# EAGLE design motherboard fully tracked (EAGLE 5.11)
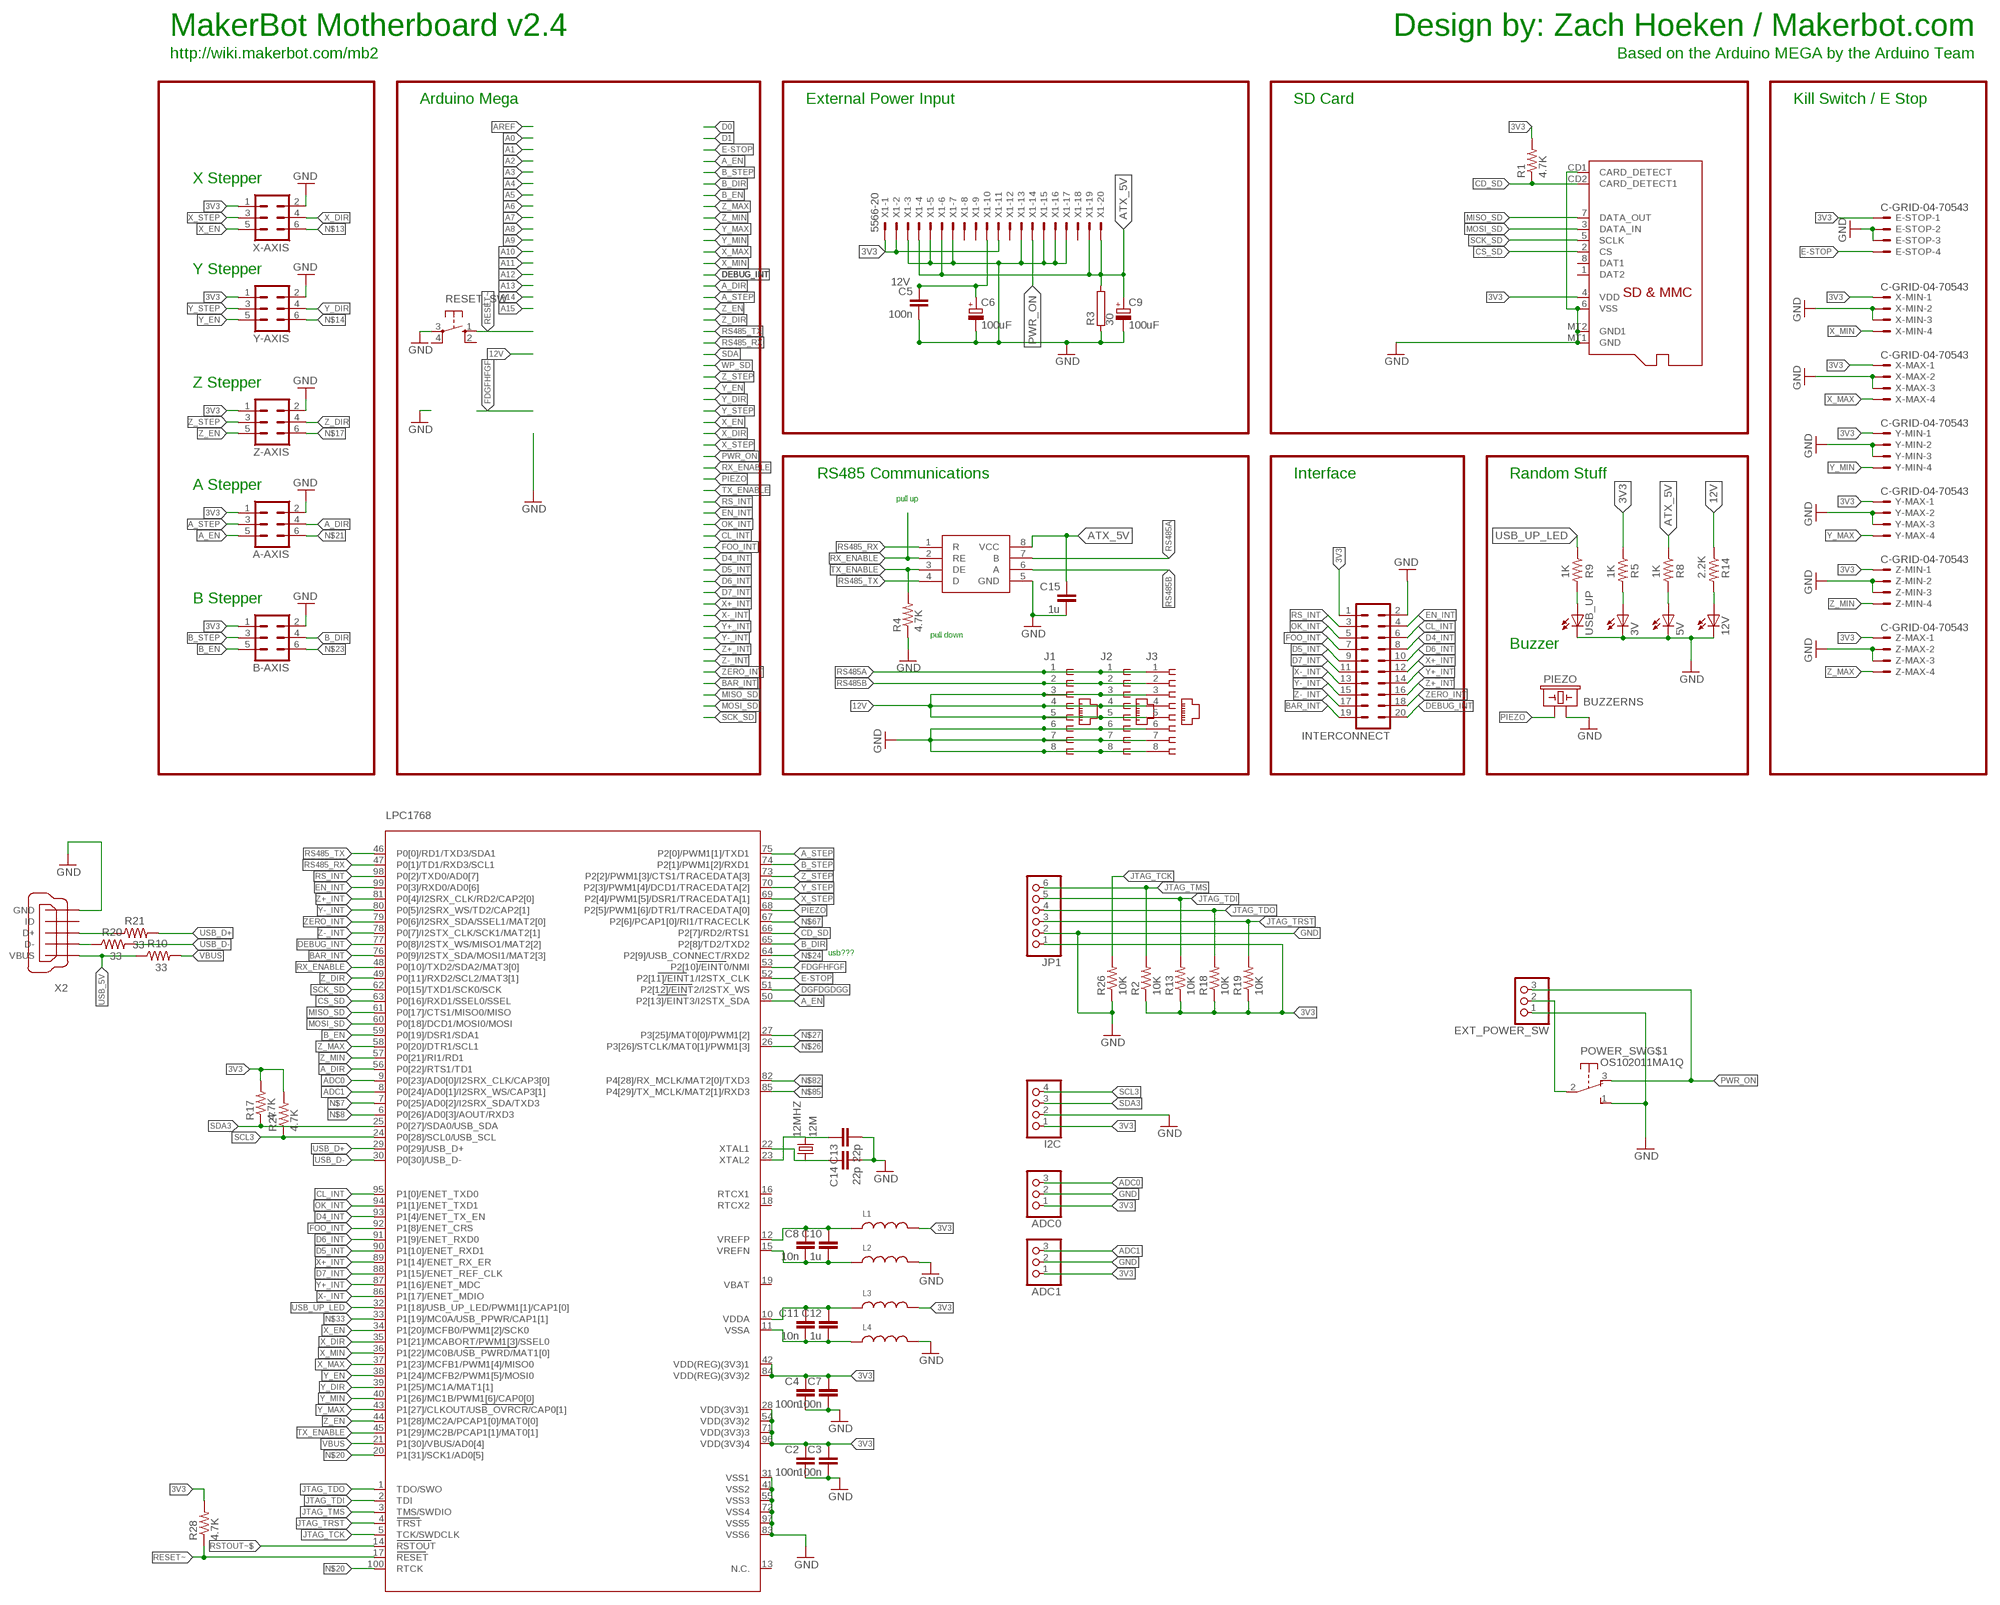
[diagram p0: schematic, sheet 1]

## Parts
3V  LED0805  [LED-0805]
5V  LED0805  [LED-0805]
12MHZ  12M  CRYSTALHC49U-V  [HC49U-V]
12V  LED0805  [LED-0805]
A-AXIS  MA03-2  [MA03-2]
ADC0  HEADER-1X3ROUND  [1X03_ROUND]
ADC1  HEADER-1X3ROUND  [1X03_ROUND]
B-AXIS  MA03-2  [MA03-2]
C2  100n  CAP0805  [0805]
C3  100n  CAP0805  [0805]
C4  100n  CAP0805  [0805]
C5  100n  CAP0805  [0805]
C6  100uF  CPOL-EUE2.5-5  [E2,5-5]
C7  100n  CAP0805  [0805]
C8  10n  CAP0805  [0805]
C9  100uF  CPOL-EUE2.5-5  [E2,5-5]
C10  1u  CAP0805  [0805]
C11  10n  CAP0805  [0805]
C12  1u  CAP0805  [0805]
C13  22p  CAP0805  [0805]
C14  22p  CAP0805  [0805]
C15  1u  CAP0805  [0805]
E-STOP  C-GRID-04-70543  [70543-04]
EXT_POWER_SW  HEADER-1X3ROUND  [1X03_ROUND]
I2C  HEADER-1X4ROUND  [1X04_ROUND]
INTERCONNECT  MA10-2  [MA10-2]
J1  556416-1  [556416-1]
J2  556416-1  [556416-1]
J3  556416-1  [556416-1]
JP1  HEADER-1X6ROUND  [1X06_ROUND]
L1  INDUCTOR0603  [0603]
L2  INDUCTOR0603  [0603]
L3  INDUCTOR0603  [0603]
L4  INDUCTOR0603  [0603]
LPC1768  LPC1768  [LQFP100]
MICRO_SD  MICROSD  [MICROSD]
PIEZO  BUZZERNS  [BUZZER-12MM-NS]
POWER_SW  OS102011MA1Q  [OS102011MA1Q]
R1  4.7K  RESISTOR  [0805]
R2  10K  RESISTOR  [0805]
R3  30  RKH208-8R  [KH208R-8]
R4  4.7K  RESISTOR  [0805]
R5  1K  RESISTOR  [0805]
R8  1K  RESISTOR  [0805]
R9  1K  RESISTOR  [0805]
R10  33  RESISTOR  [0805]
R13  10K  RESISTOR  [0805]
R14  2.2K  RESISTOR  [0805]
R17  4.7K  RESISTOR  [0805]
R18  10K  RESISTOR  [0805]
R19  10K  RESISTOR  [0805]
R20  33  RESISTOR  [0805]
R21  33  RESISTOR  [0805]
R26  10K  RESISTOR  [0805]
R27  4.7K  RESISTOR  [0805]
R28  4.7K  RESISTOR  [0805]
RESET_SW  10-XX  [B3F-10XX]
RS244  SN75176ASOIC  [SO08]
USB_UP  LED0805  [LED-0805]
X1  5566-20  [5566-20]
X2  MINI-USB_SHIELD5P2-32005-601  [32005-601]
X-AXIS  MA03-2  [MA03-2]
X-MAX  C-GRID-04-70543  [70543-04]
X-MIN  C-GRID-04-70543  [70543-04]
Y-AXIS  MA03-2  [MA03-2]
Y-MAX  C-GRID-04-70543  [70543-04]
Y-MIN  C-GRID-04-70543  [70543-04]
Z-AXIS  MA03-2  [MA03-2]
Z-MAX  C-GRID-04-70543  [70543-04]
Z-MIN  C-GRID-04-70543  [70543-04]

## Nets
3V3: A-AXIS.1 ADC0.1 ADC1.1 B-AXIS.1 C2.1 C3.1 C4.1 C7.1 E-STOP.1 I2C.1 INTERCONNECT.1 JP1.1 L1.2 L3.2 LPC1768.28(VDD(3V3)1) LPC1768.42(VDD(REG)(3V3)1) LPC1768.54(VDD(3V3)2) LPC1768.71(VDD(3V3)3) LPC1768.84(VDD(REG)(3V3)2) LPC1768.96(VDD(3V3)4) MICRO_SD.4(VDD) R1.2 R2.1 R5.1 R13.1 R17.2 R18.1 R19.1 R27.2 R28.2 X1.1 X1.2 X1.11 X-AXIS.1 X-MAX.1 X-MIN.1 Y-AXIS.1 Y-MAX.1 Y-MIN.1 Z-AXIS.1 Z-MAX.1 Z-MIN.1
12V [12v]: C5.1 C6.+ J1.3 J1.4 J1.5 J2.3 J2.4 J2.5 J3.3 J3.4 J3.5 R14.1 X1.10
A_DIR: A-AXIS.4 LPC1768.56(P0[22]/RTS1/TD1)
A_EN: A-AXIS.5 LPC1768.50(P2[13]/EINT3/I2STX_SDA)
A_STEP: A-AXIS.3 LPC1768.75(P2[0]/PWM1[1]/TXD1)
ADC0: ADC0.3 LPC1768.9(P0[23]/AD0[0]/I2SRX_CLK/CAP3[0])
ADC1: ADC1.3 LPC1768.8(P0[24]/AD0[1]/I2SRX_WS/CAP3[1])
ATX_5V [power]: C9.+ C15.1 R3.2 R8.1 RS244.8(VCC) X1.4 X1.6 X1.19 X1.20
B_DIR: B-AXIS.4 LPC1768.65(P2[8]/TD2/TXD2)
B_EN: B-AXIS.5 LPC1768.59(P0[19]/DSR1/SDA1)
B_STEP: B-AXIS.3 LPC1768.74(P2[1]/PWM1[2]/RXD1)
BAR_INT: INTERCONNECT.19 LPC1768.76(P0[9]/I2STX_SDA/MOSI1/MAT2[3])
CD_SD: LPC1768.66(P2[7]/RD2/RTS1) MICRO_SD.CD2(CARD_DETECT1) R1.1
CL_INT: INTERCONNECT.6 LPC1768.95(P1[0]/ENET_TXD0)
CS_SD: LPC1768.63(P0[16]/RXD1/SSEL0/SSEL) MICRO_SD.2(CS)
D4_INT: INTERCONNECT.8 LPC1768.93(P1[4]/ENET_TX_EN)
D5_INT: INTERCONNECT.9 LPC1768.90(P1[10]/ENET_RXD1)
D6_INT: INTERCONNECT.10 LPC1768.91(P1[9]/ENET_RXD0)
D7_INT: INTERCONNECT.11 LPC1768.88(P1[15]/ENET_REF_CLK)
DEBUG_INT: INTERCONNECT.20 LPC1768.77(P0[8]/I2STX_WS/MISO1/MAT2[2])
DGFDGDGG: LPC1768.51(P2[12]/EINT2/I2STX_WS)
E-STOP: E-STOP.4 LPC1768.52(P2[11]/EINT1/I2STX_CLK)
EN_INT: INTERCONNECT.4 LPC1768.99(P0[3]/RXD0/AD0[6])
FDGFHFGF: LPC1768.53(P2[10]/EINT0/NMI)
FOO_INT: INTERCONNECT.7 LPC1768.92(P1[8]/ENET_CRS)
GND [gnd]: 3V.C 5V.C 12V.C A-AXIS.2 ADC0.2 ADC1.2 B-AXIS.2 C2.2 C3.2 C4.2 C5.2 C6.- C7.2 C9.- C13.2 C14.2 C15.2 E-STOP.2 E-STOP.3 EXT_POWER_SW.1 I2C.2 INTERCONNECT.2 J1.6 J1.7 J1.8 J2.6 J2.7 J2.8 J3.6 J3.7 J3.8 JP1.2 L2.2 L4.2 LPC1768.31(VSS1) LPC1768.41(VSS2) LPC1768.55(VSS3) LPC1768.72(VSS4) LPC1768.83(VSS6) LPC1768.97(VSS5) MICRO_SD.6(VSS) MICRO_SD.CD1(CARD_DETECT) MICRO_SD.MT1(GND) MICRO_SD.MT2(GND1) PIEZO.- POWER_SW.1(S) R3.1 R4.1 R26.1 RESET_SW.3(P) RS244.5(GND) USB_UP.C X1.3 X1.5 X1.7 X1.13 X1.15 X1.16 X1.17 X2.5(GND) X-AXIS.2 X-MAX.2 X-MAX.3 X-MIN.2 X-MIN.3 Y-AXIS.2 Y-MAX.2 Y-MAX.3 Y-MIN.2 Y-MIN.3 Z-AXIS.2 Z-MAX.2 Z-MAX.3 Z-MIN.2 Z-MIN.3
JTAG_TCK: LPC1768.5(TCK/SWDCLK) R26.2
JTAG_TDI: JP1.5 LPC1768.2(TDI) R13.2
JTAG_TDO: JP1.4 LPC1768.1(TDO/SWO) R18.2
JTAG_TMS: JP1.6 LPC1768.3(TMS/SWDIO) R2.2
JTAG_TRST: JP1.3 LPC1768.4(TRST) R19.2
MISO_SD: LPC1768.61(P0[17]/CTS1/MISO0/MISO) MICRO_SD.7(DATA_OUT)
MOSI_SD: LPC1768.60(P0[18]/DCD1/MOSI0/MOSI) MICRO_SD.3(DATA_IN)
N$1: 3V.A R5.2
N$2: R9.2 USB_UP.A
N$3: 5V.A R8.2
N$4: EXT_POWER_SW.2 POWER_SW.2(P)
N$7: LPC1768.7(P0[25]/AD0[2]/I2SRX_SDA/TXD3)
N$8: LPC1768.6(P0[26]/AD0[3]/AOUT/RXD3)
N$10: 12V.A R14.2
N$13: X-AXIS.6
N$14: Y-AXIS.6
N$17: Z-AXIS.6
N$20: LPC1768.20(P1[31]/SCK1/AD0[5]) LPC1768.100(RTCK)
N$21: A-AXIS.6
N$23: B-AXIS.6
N$24: LPC1768.64(P2[9]/USB_CONNECT/RXD2)
N$26: LPC1768.26(P3[26]/STCLK/MAT0[1]/PWM1[3])
N$27: LPC1768.27(P3[25]/MAT0[0]/PWM1[2])
N$31: C8.1 C10.1 L1.1 LPC1768.12(VREFP)
N$32: C8.2 C10.2 L2.1 LPC1768.15(VREFN)
N$33: 12MHZ.2 C13.1 LPC1768.23(XTAL2) LPC1768.33(P1[19]/MC0A/USB_PPWR/CAP1[1])
N$34: 12MHZ.1 C14.1 LPC1768.22(XTAL1)
N$35: C11.1 C12.1 L3.1 LPC1768.10(VDDA)
N$38: C11.2 C12.2 L4.1 LPC1768.11(VSSA)
N$67: LPC1768.67(P2[6]/PCAP1[0]/RI1/TRACECLK)
N$82: LPC1768.82(P4[28]/RX_MCLK/MAT2[0]/TXD3)
N$85: LPC1768.85(P4[29]/TX_MCLK/MAT2[1]/RXD3)
OK_INT: INTERCONNECT.5 LPC1768.94(P1[1]/ENET_TXD1)
PIEZO: LPC1768.68(P2[5]/PWM1[6]/DTR1/TRACEDATA[0]) PIEZO.+
PWR_ON: EXT_POWER_SW.3 POWER_SW.3(O) X1.14
RESET~: LPC1768.17(RESET) R28.1 RESET_SW.1(S)
RS485_RX: LPC1768.47(P0[1]/TD1/RXD3/SCL1) RS244.1(R)
RS485_TX: LPC1768.46(P0[0]/RD1/TXD3/SDA1) RS244.4(D)
RS485A: J1.1 J2.1 J3.1 RS244.7(B)
RS485B: J1.2 J2.2 J3.2 RS244.6(A)
RS_INT: INTERCONNECT.3 LPC1768.98(P0[2]/TXD0/AD0[7])
RSTOUT~$: LPC1768.14(RSTOUT)
RX_ENABLE: LPC1768.48(P0[10]/TXD2/SDA2/MAT3[0]) RS244.2(RE)
SCK_SD: LPC1768.62(P0[15]/TXD1/SCK0/SCK) MICRO_SD.5(SCLK)
SCL3: I2C.4 LPC1768.24(P0[28]/SCL0/USB_SCL) R27.1
SDA3: I2C.3 LPC1768.25(P0[27]/SDA0/USB_SDA) R17.1
TX_ENABLE: LPC1768.45(P1[29]/MC2B/PCAP1[1]/MAT0[1]) R4.2 RS244.3(DE)
USB_5V [12v]: R10.1 X2.1(VBUS)
USB_D+: LPC1768.29(P0[29]/USB_D+) R21.2
USB_D+_CON: R21.1 X2.3(D+)
USB_D-: LPC1768.30(P0[30]/USB_D-) R20.2
USB_D-_CON: R20.1 X2.2(D-)
USB_UP_LED: LPC1768.32(P1[18]/USB_UP_LED/PWM1[1]/CAP1[0]) R9.1
VBUS: LPC1768.21(P1[30]/VBUS/AD0[4]) R10.2
X+_INT: INTERCONNECT.12 LPC1768.89(P1[14]/ENET_RX_ER)
X-_INT: INTERCONNECT.13 LPC1768.86(P1[17]/ENET_MDIO)
X_DIR: LPC1768.35(P1[21]/MCABORT/PWM1[3]/SSEL0) X-AXIS.4
X_EN: LPC1768.34(P1[20]/MCFB0/PWM1[2]/SCK0) X-AXIS.5
X_MAX: LPC1768.37(P1[23]/MCFB1/PWM1[4]/MISO0) X-MAX.4
X_MIN: LPC1768.36(P1[22]/MC0B/USB_PWRD/MAT1[0]) X-MIN.4
X_STEP: LPC1768.69(P2[4]/PWM1[5]/DSR1/TRACEDATA[1]) X-AXIS.3
Y+_INT: INTERCONNECT.14 LPC1768.87(P1[16]/ENET_MDC)
Y-_INT: INTERCONNECT.15 LPC1768.80(P0[5]/I2SRX_WS/TD2/CAP2[1])
Y_DIR: LPC1768.39(P1[25]/MC1A/MAT1[1]) Y-AXIS.4
Y_EN: LPC1768.38(P1[24]/MCFB2/PWM1[5]/MOSI0) Y-AXIS.5
Y_MAX: LPC1768.43(P1[27]/CLKOUT/USB_OVRCR/CAP0[1]) Y-MAX.4
Y_MIN: LPC1768.40(P1[26]/MC1B/PWM1[6]/CAP0[0]) Y-MIN.4
Y_STEP: LPC1768.70(P2[3]/PWM1[4]/DCD1/TRACEDATA[2]) Y-AXIS.3
Z+_INT: INTERCONNECT.16 LPC1768.81(P0[4]/I2SRX_CLK/RD2/CAP2[0])
Z-_INT: INTERCONNECT.17 LPC1768.78(P0[7]/I2STX_CLK/SCK1/MAT2[1])
Z_DIR: LPC1768.49(P0[11]/RXD2/SCL2/MAT3[1]) Z-AXIS.4
Z_EN: LPC1768.44(P1[28]/MC2A/PCAP1[0]/MAT0[0]) Z-AXIS.5
Z_MAX: LPC1768.58(P0[20]/DTR1/SCL1) Z-MAX.4
Z_MIN: LPC1768.57(P0[21]/RI1/RD1) Z-MIN.4
Z_STEP: LPC1768.73(P2[2]/PWM1[3]/CTS1/TRACEDATA[3]) Z-AXIS.3
ZERO_INT: INTERCONNECT.18 LPC1768.79(P0[6]/I2SRX_SDA/SSEL1/MAT2[0])
Unconnected: LPC1768.13(N.C.) LPC1768.16(RTCX1) LPC1768.18(RTCX2) LPC1768.19(VBAT) MICRO_SD.1(DAT2) MICRO_SD.8(DAT1) POWER_SW.MT1(MT) POWER_SW.MT2(MT) RESET_SW.2(S1) RESET_SW.4(P1) X1.8 X1.9 X1.12 X1.18 X2.4(ID) X2.M1(S1) X2.M2(S2)

## Notes on the sheet
- Design by: Zach Hoeken / Makerbot.com
- MakerBot Motherboard v2.4
- Based on the Arduino MEGA by the Arduino Team
- http://wiki.makerbot.com/mb2
- Arduino Mega | External Power Input | SD Card | Kill Switch / E Stop
- X Stepper
- Y Stepper
- Z Stepper
- RS485 Communications | Interface | Random Stuff
- A Stepper
- pull up
- B Stepper
- pull down
- Buzzer
- usb???

## Library data of the parts
3V 5V 12V USB_UP = SparkFun:LED: LEDs Standard schematic elements and footprints for 5mm, 3mm, 1206, and 0603 sized LEDs. 5mm - Spark Fun Electronics SKU : COM-00529 (and others)
12MHZ = crystal:CRYSTAL: CRYSTAL; OC_FARNELL: 1666969; OC_NEWARK: unknown
A-AXIS B-AXIS X-AXIS Y-AXIS Z-AXIS = con-lstb:MA03-2: PIN HEADER; OC_FARNELL: unknown; OC_NEWARK: unknown
ADC0 ADC1 EXT_POWER_SW = microbuilder:HEADER-1X3: PIN HEADER
C2-C5 C7 C8 C10-C15 = SparkFun:CAP: Capacitor Standard 0603 ceramic capacitor, and 0.1" leaded capacitor.
C6 C9 = resistor:CPOL-EU: POLARIZED CAPACITOR, European symbol
E-STOP X-MAX X-MIN Y-MAX Y-MIN Z-MAX Z-MIN = con-molex:C-GRID-04: CONNECTOR wire to board 2.54 mm (0.100") pitch header; OC_FARNELL: unknown; OC_NEWARK: unknown
I2C = microbuilder:HEADER-1X4: PIN HEADER
INTERCONNECT = con-lstb:MA10-2: PIN HEADER; OC_FARNELL: unknown; OC_NEWARK: unknown
J1-J3 = con-amp:556416-1: AMP connector
JP1 = microbuilder:HEADER-1X6: PIN HEADER
L1-L4 = microbuilder:INDUCTOR: Inductors 0603: 10nH Ceramic Inductor - microwire antenna/RF (Digikey: 712-1434-2-ND) 0805: 560nH Ceramic Inductor - RF (Digikey: 553-1047-1-ND) 1007 (2518 Metric) SMT: 10µH 10% 250mOhm 820mA 1007 Inductor (Digikey: 587-2189-1-ND) 22µH 10% 500mOhm 580mA 1007 Inductor (Digikey: 587-2190-1-ND) 47µH 10% 950mOhm 420mA 1007 Inductor (Digikey: 587-2191-1-ND) 47µH 5% 100mOhm 1A 1008 Inductor (Digikey: 732-1816-1-ND)
LPC1768 = microbuilder:LPC1768: LPC1768 100 MHz 32-bit ARM Cortex-M3 based microcontroller featuring a high level of integration and low power consumption. 512 kB Flash, 64 kB SRAM, USB Device/Host/OTG, Ethernet, CAN, I2S, 10-bit DAC Digikey: 568-4796-ND
MICRO_SD = adafruit:MICROSD: Micro-SD / Transflash card holder with SPI pinout For the 3M # 2908-05WB-MG and/or 4UCON #19656 push-push type
PIEZO = SparkFun:BUZZER: Buzzer 12mm Spark Fun Electronics SKU : Comp-Buzzer
POWER_SW = adafruit:OS102011MA1Q: OS10201MA1Q through-hole right angle switch http://www.ladyada.net/library/eagle
R1 R2 R4 R5 R8-R10 R13 R14 R17-R21 R26-R28 = SparkFun:RESISTOR: Resistor Basic schematic elements and footprints for 0603, 1206, and PTH 1/10th watt (small) resistors.
R3 = resistor-power:R: Power Resitor
RESET_SW = switch-omron:10-XX: OMRON SWITCH; MPN: B3F-1000; OC_FARNELL: 176432; OC_NEWARK: 36M3542
RS244 = reprap:SN75176A
X1 = con-molex:5566-20: Mini FIT connector 20 pol ATX PC-Motherboard Power connector Source: http://www.molex.com; OC_FARNELL: unknown; OC_NEWARK: unknown
X2 = con-cypressindustries:MINI-USB_SHIELD5P2-: MINI USB-B R/A DIP 5pol. Source: www.cypressindustries.com; OC_FARNELL: unknown; OC_NEWARK: unknown

## Net classes
0 default: width 0.203 mm, drill 0.508 mm, clearance 0.203 mm
1 power: width 0.508 mm, drill 0.508 mm, clearance 0.203 mm
2 gnd: width 0.305 mm, drill 0.508 mm, clearance 0.203 mm
3 12v: width 1.016 mm, drill 0.711 mm, clearance 0.203 mm

## Board
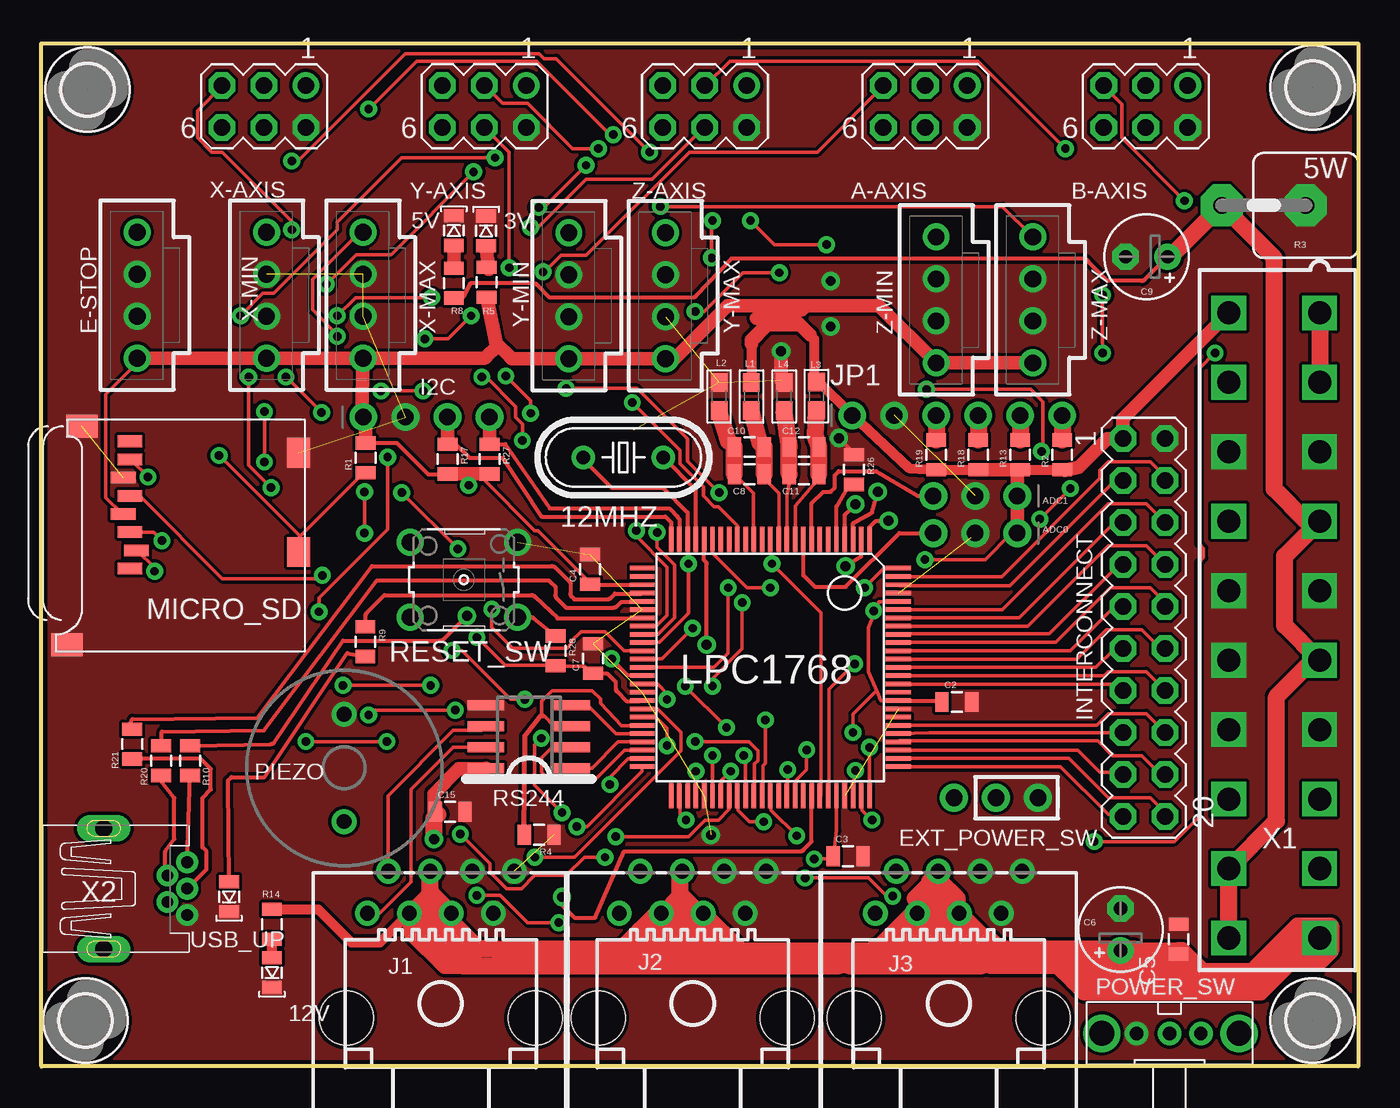
[diagram p1: board, top side]
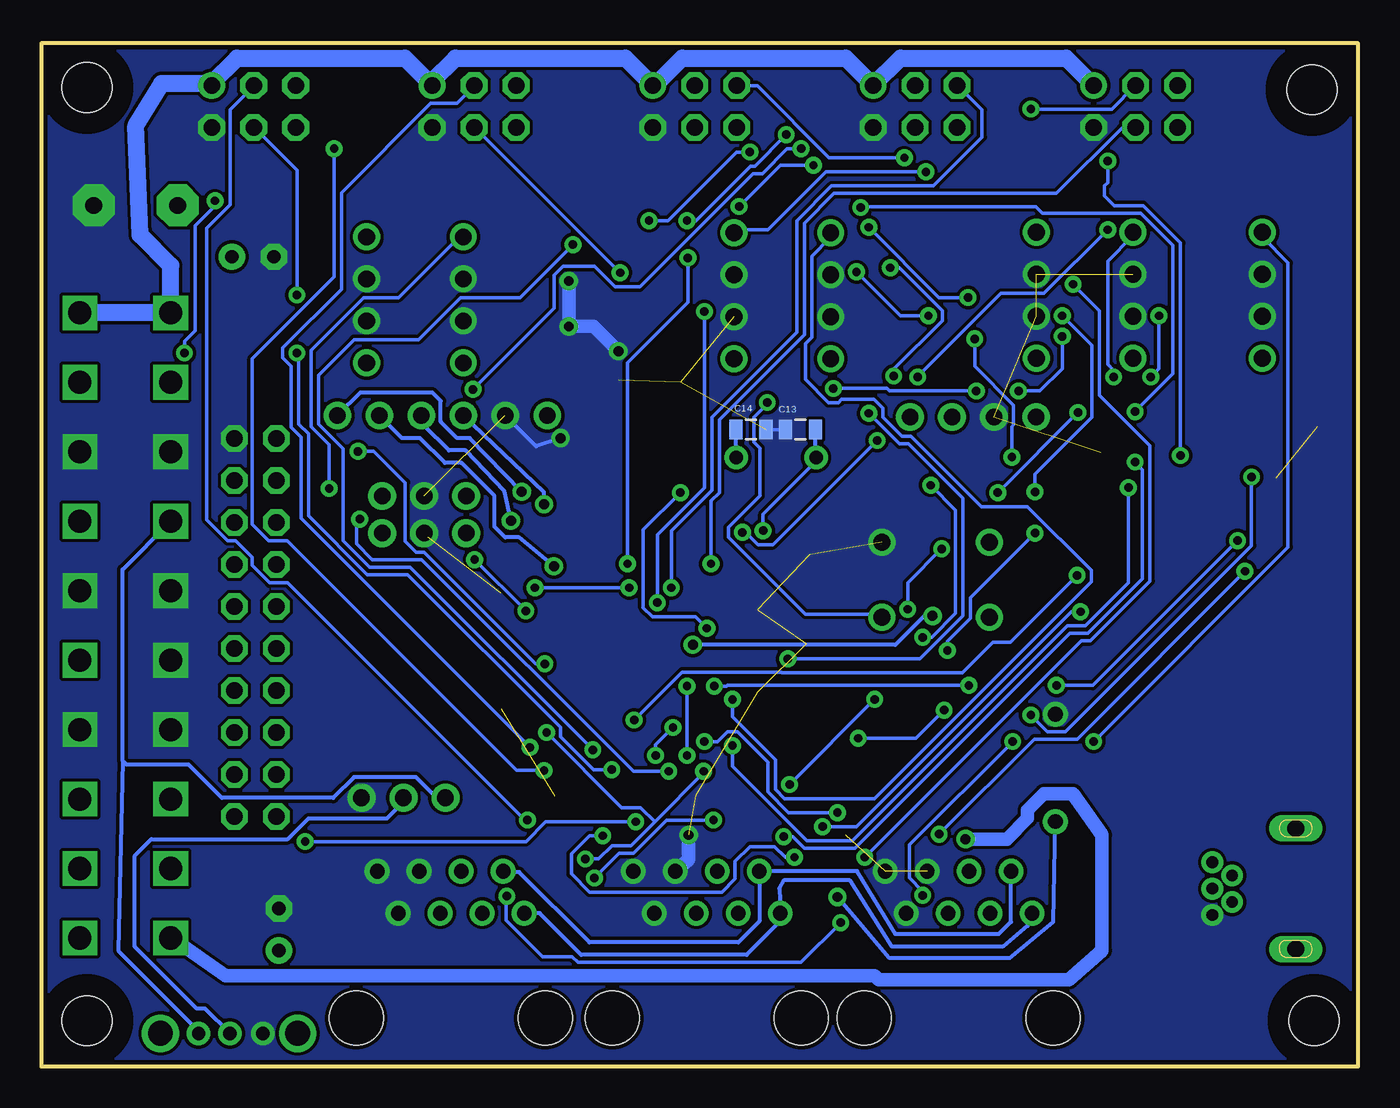
[diagram p2: board, bottom side, seen from below]

Size 79.66 x 61.87 mm. Coordinates in mm from the lower left corner, seen from the top.
Outline: 0,61.87 79.66,61.87 79.66,0 0,0 0,61.87
Copper layers (1*16): Top 0.035mm / dielectric 1.53mm / Bottom 0.035mm
Design rules "SparkFun *": minimum track width 8mil, minimum drill 0.4mm, track to track 8mil, track to pad 8mil, pad to pad 8mil, via to via 8mil, smd to smd 8mil, copper to edge 10mil, drill to drill 8mil, minimum pad ring 12mil, minimum via ring 10mil, stop-mask expansion 4mil, vias tented up to drill 25mil, thermal gap 10mil

### Footprints (pad centres in the part's own frame; a part is rotated, then mirrored left to right if it is on the bottom)
LED-0805 = smd 1.2 x 0.8: A 0,-0.9; C 0,0.9
HC49U-V = drill 0.813 round: 1 -2.413,0; 2 2.413,0
MA03-2 = drill 1.016 round: 1 -2.54,-1.27 | drill 1.016 octagon: 2 -2.54,1.27; 3 0,-1.27; 4 0,1.27; 5 2.54,-1.27; 6 2.54,1.27
1X03_ROUND = drill 1 pad 1.676 round: 1 -2.54,0; 2 0,0; 3 2.54,0
0805 = smd 0.8 x 1.2: 1 -0.9,0; 2 0.9,0
E2,5-5 = drill 0.813 pad 1.6 round: + -1.27,0 | drill 0.813 pad 1.6 octagon: - 1.27,0
70543-04 = drill 1.016 round: 1 -3.81,0; 2 -1.27,0; 3 1.27,0; 4 3.81,0
1X04_ROUND = drill 1 pad 1.676 round: 1 -3.81,0; 2 -1.27,0; 3 1.27,0; 4 3.81,0
MA10-2 = drill 1.016 octagon: 1 -11.43,-1.27; 2 -11.43,1.27; 3 -8.89,-1.27; 4 -8.89,1.27; 5 -6.35,-1.27; 6 -6.35,1.27; 7 -3.81,-1.27; 8 -3.81,1.27; 9 -1.27,-1.27; 10 -1.27,1.27; 11 1.27,-1.27; 12 1.27,1.27; 13 3.81,-1.27; 14 3.81,1.27; 15 6.35,-1.27; 16 6.35,1.27; 17 8.89,-1.27; 18 8.89,1.27; 19 11.43,-1.27; 20 11.43,1.27
556416-1 = drill 0.889 round: 1 -4.445,5.461; 2 -3.175,8.001; 3 -1.905,5.461; 4 -0.635,8.001; 5 0.635,5.461; 6 1.905,8.001; 7 3.175,5.461; 8 4.445,8.001 | hole 3.251: -5.715,-0.889; 5.715,-0.889
1X06_ROUND = drill 1 pad 1.676 round: 1 -6.35,0; 2 -3.81,0; 3 -1.27,0; 4 1.27,0; 5 3.81,0; 6 6.35,0
0603 = smd 1.1 x 1: 1 -0.85,0; 2 0.85,0
LQFP100 = smd 0.27 x 1.5: 1 -6,-7.75; 2 -5.5,-7.75; 3 -5,-7.75; 4 -4.5,-7.75; 5 -4,-7.75; 6 -3.5,-7.75; 7 -3,-7.75; 8 -2.5,-7.75; 9 -2,-7.75; 10 -1.5,-7.75; 11 -1,-7.75; 12 -0.5,-7.75; 13 0,-7.75; 14 0.5,-7.75; 15 1,-7.75; 16 1.5,-7.75; 17 2,-7.75; 18 2.5,-7.75; 19 3,-7.75; 20 3.5,-7.75; 21 4,-7.75; 22 4.5,-7.75; 23 5,-7.75; 24 5.5,-7.75; 25 6,-7.75; 51 6,7.75; 52 5.5,7.75; 53 5,7.75; 54 4.5,7.75; 55 4,7.75; 56 3.5,7.75; 57 3,7.75; 58 2.5,7.75; 59 2,7.75; 60 1.5,7.75; 61 1,7.75; 62 0.5,7.75; 63 0,7.75; 64 -0.5,7.75; 65 -1,7.75; 66 -1.5,7.75; 67 -2,7.75; 68 -2.5,7.75; 69 -3,7.75; 70 -3.5,7.75; 71 -4,7.75; 72 -4.5,7.75; 73 -5,7.75; 74 -5.5,7.75; 75 -6,7.75 | smd 1.5 x 0.27: 26 7.75,-6; 27 7.75,-5.5; 28 7.75,-5; 29 7.75,-4.5; 30 7.75,-4; 31 7.75,-3.5; 32 7.75,-3; 33 7.75,-2.5; 34 7.75,-2; 35 7.75,-1.5; 36 7.75,-1; 37 7.75,-0.5; 38 7.75,0; 39 7.75,0.5; 40 7.75,1; 41 7.75,1.5; 42 7.75,2; 43 7.75,2.5; 44 7.75,3; 45 7.75,3.5; 46 7.75,4; 47 7.75,4.5; 48 7.75,5; 49 7.75,5.5; 50 7.75,6; 76 -7.75,6; 77 -7.75,5.5; 78 -7.75,5; 79 -7.75,4.5; 80 -7.75,4; 81 -7.75,3.5; 82 -7.75,3; 83 -7.75,2.5; 84 -7.75,2; 85 -7.75,1.5; 86 -7.75,1; 87 -7.75,0.5; 88 -7.75,0; 89 -7.75,-0.5; 90 -7.75,-1; 91 -7.75,-1.5; 92 -7.75,-2; 93 -7.75,-2.5; 94 -7.75,-3; 95 -7.75,-3.5; 96 -7.75,-4; 97 -7.75,-4.5; 98 -7.75,-5; 99 -7.75,-5.5; 100 -7.75,-6
MICROSD = smd 0.7 x 1.5: 1 9,-10.64; 2 7.9,-10.24; 3 6.8,-10.64; 4 5.7,-11.04; 5 4.6,-10.64; 6 3.5,-11.04; 7 2.4,-10.64; 8 1.3,-10.64 | smd 1.8 x 1.4: CD1 2,-0.44; CD2 8,-0.44 | smd 1.4 x 1.9: MT1 0.4,-13.54; MT2 13.6,-14.44
BUZZER-12MM-NS = drill 0.9 round: + 3.25,0; - -3.25,0
OS102011MA1Q = drill 0.8 pad 1.422 round: 1 -2,0; 2 0,0; 3 1.9,0 | drill 1.5 pad 2.184 round: MT1 -4.1,0; MT2 4.2,0
KH208R-8 = drill 1.016 pad 2.54 octagon: 1 -2.54,0; 2 2.54,0
B3F-10XX = drill 1.016 round: 1 -3.251,2.261; 2 3.251,2.261; 3 -3.251,-2.261; 4 3.251,-2.261
SO08 = smd 0.6 x 2.2: 1 -1.905,-2.6; 2 -0.635,-2.6; 3 0.635,-2.6; 4 1.905,-2.6; 5 1.905,2.6; 6 0.635,2.6; 7 -0.635,2.6; 8 -1.905,2.6
3,0 = hole 3: 0,0
5566-20 = drill 1.4 square: 1 18.9,-2.75; 2 14.7,-2.75; 3 10.5,-2.75; 4 6.3,-2.75; 5 2.1,-2.75; 6 -2.1,-2.75; 7 -6.3,-2.75; 8 -10.5,-2.75; 9 -14.7,-2.75; 10 -18.9,-2.75; 11 18.9,2.75; 12 14.7,2.75; 13 10.5,2.75; 14 6.3,2.75; 15 2.1,2.75; 16 -2.1,2.75; 17 -6.3,2.75; 18 -10.5,2.75; 19 -14.7,2.75; 20 -18.9,2.75
32005-601 = drill 0.7 pad 0.813 round: 1 2.825,1.6; 2 1.625,0.8; 3 2.825,0; 4 1.625,-0.8; 5 2.825,-1.6 | drill 1 pad 1.422 long: M1 -2.225,3.65; M2 -2.225,-3.65

### Placement (x,y rotation side)
3V  26.91,50.53 0 top
5V  24.96,50.55 0 top
12MHZ  35.21,36.83 180 top
12V  13.95,5.67 180 top
A-AXIS  53.47,58.05 180 top
ADC0  56.5,32.25 180 top
ADC1  56.5,34.5 180 top
B-AXIS  66.81,58.05 180 top
C2  55.38,22.04 0 top
C3  48.81,12.72 0 top
C4  33.19,30.06 90 top
C5  68.8,7.7 90 top
C6  65.28,8.28 90 top
C7  33.37,24.67 90 top
C8  42.83,35.81 180 top
C9  66.86,48.97 180 top
C10  42.83,37.47 180 top
C11  46.14,35.81 180 top
C12  46.14,37.47 180 top
C13  33.74,38.52 180 bottom
C14  36.73,38.52 0 bottom
C15  24.74,15.4 0 top
E-STOP  5.8,46.64 90 top
EXT_POWER_SW  57.75,16.25 180 top
I2C  23.3,39.27 0 top
INTERCONNECT  66.71,26.54 270 top
J1  24.16,3.81 0 top
J2  39.4,3.81 0 top
J3  54.9,3.81 0 top
JP1  55.4,39.37 0 top
L1  42.96,40.51 90 top
L2  41,40.51 90 top
L3  46.89,40.54 90 top
L4  44.94,40.51 90 top
LPC1768  44.1,24.13 180 top
MICRO_SD  16,39.11 270 top
PIEZO  18.32,18.06 270 top
POWER_SW  68.25,2 0 top
R1  19.61,36.8 90 top
R2  61.75,36.98 90 top
R3  73.95,52.07 180 top
R4  30.11,14 180 top
R5  26.94,47.42 90 top
R8  24.96,47.37 90 top
R9  19.61,25.69 270 top
R10  9,18.5 90 top
R13  59.21,36.98 90 top
R14  13.95,8.6 270 top
R17  24.57,36.73 270 top
R18  56.67,36.98 90 top
R19  54.13,36.98 90 top
R20  7.25,18.5 90 top
R21  5.5,19.5 90 top
R26  49.15,36.1 270 top
R27  27.11,36.73 270 top
R28  31.1,25.14 270 top
RESET_SW  25.56,29.43 180 top
RS244  29.5,19.94 90 top
U$4  [3,0]  2.79,59.07 0 top
U$5  [3,0]  76.9,59.2 0 top
U$6  [3,0]  76.9,2.77 0 top
U$7  [3,0]  2.67,2.77 0 top
USB_UP  11.36,10.26 180 top
X1  74.58,26.67 90 top
X2  6,10.75 0 top
X-AXIS  13.47,58.05 180 top
X-MAX  19.46,46.64 90 top
X-MIN  13.62,46.64 90 top
Y-AXIS  26.8,58.05 180 top
Y-MAX  37.75,46.61 90 top
Y-MIN  31.91,46.61 90 top
Z-AXIS  40.14,58.05 180 top
Z-MAX  59.98,46.35 90 top
Z-MIN  54.13,46.35 90 top

### Tracks (layer width: path | path; a pad name or v marks a point on that pad's centre or on a via)
3V3  (via drill 0.51)
  Top 0.203: LPC1768.71 48.1,14.28 C3.1 47.85,12.65 47.75,12.55 v46.75,12.55 | LPC1768.84 50.78,22.13 50.54,22.69 | 50.54,22.69 50.03,23.88 50.03,26.54 50.44,27.51 | 50.44,27.51 50.69,28.09 51.79,28.09 LPC1768.96 | v39.6,17.85 39.6,16.4 LPC1768.54 | v49.1,20.2 49.1,21.3 50.45,22.65 50.54,22.69 | C7.1 33.25,23.8 32.85,24.2 31.15,24.2 R28.2 31,24.25 28.05,24.25 v26.35,25.95 | MICRO_SD.4 4.95,33.45 4.85,33.45 3.9,34.4 3.9,40.65 5.7,42.45 E-STOP.1 | 25.85,35.83 v25.85,35.15 | C4.1 33.1,29.25 33.1,29.35 30.05,32.4 29.85,32.4 26.8,35.45 R27.2 | Y-MAX.1 | v53.45,30.65 57.1,30.65 58.65,32.2 ADC0.1 | v50.35,27.55 50.44,27.51
  Top 0.254: L3.2 46.93,41.49 | R1.2 21.5,37.7 23.4,35.8 24.54,35.8 R17.2 | C7.1 34.12,23.77 arc-45 34.3,23.7 34.75,23.25 34.75,22.86 arc45 34.82,22.68 35.4,22.1 36.18,22.1 arc-45 LPC1768.42 | LPC1768.28 33.4,29.13 arc45 C4.1 | LPC1768.84 54.4,22.13 C2.1
  Top 0.61: R18.1 R19.1 52.49,36.18 JP1.1 46.93,41.49 | R13.1 R2.1 | L1.2 42.96,43.71 44,44.75 46,44.75 46.5,44.25 46.75,44 46.75,41.6 L3.2
  Top 0.813: R17.2 25.85,35.83 R27.2 | R1.2 19.61,39.16 I2C.1 19.36,39.4 X-MAX.1 | ADC1.1 ADC0.1 59.04,36.01 R13.1 R18.1 | 45,46 41.5,46 38.3,42.8 Y-MAX.1 Y-MIN.1 28.56,42.8 arc-45 28.38,42.87 27.5,43.75 | 45,46 50.68,46 Z-MIN.1 Z-MAX.1 | X1.11 65.44,39.18 INTERCONNECT.1 64.47,37.97 62.75,36.25 61.92,36.05 R2.1 | X-MAX.1 X-MIN.1 E-STOP.1 | 42.96,43.71 42.96,43.96 45,46 | 46,45.75 45.75,45.75 45,45 45,45.75 | 45,46 45,45.75 | 45,45.75 45.25,45.5 | 45.25,45.5 46.5,44.25 | 45.25,45.5 43.5,45.5 43.25,45.25 | X-MAX.1 26.73,42.83 arc45 26.91,42.91 27.5,43.5 27.5,43.75 | 27.5,43.75 27,46.27 arc45 R5.1
  Top 1.016: X1.1 X1.2
  Bottom 0.203: v39.6,17.85 39.6,17.75 42.55,14.8 | 42.55,14.8 44,13.35 45.15,13.35 45.95,12.55 v46.75,12.55 | v49.1,20.2 44.55,15.65 43.4,15.65 42.55,14.8 | v26.35,25.95 25.8,25.95 24.35,27.4 24.35,33.65 v25.85,35.15 | v53.45,30.65 v50.35,27.55
  Bottom 1.016: X1.1 X1.11 71.83,48.43 73.69,50.29 73.94,56.9 72.39,59.45 69.47,59.45 B-AXIS.1 69.35,59.45 67.82,60.98 57.66,60.98 A-AXIS.1 56.01,59.58 54.61,60.98 44.33,60.98 Z-AXIS.1 42.55,59.33 40.9,60.98 30.99,60.98 Y-AXIS.1 27.69,60.98 17.66,60.98 X-AXIS.1
12V
  Top 0.203: J1.5 26.96,7.11 27.6,7.11 35.34,7.11 36.31,8.09 J2.3
  Top 0.61: R14.1 16.75,9.5 18.75,7.5 20.49,7.5 J1.3
  Top 1.016: J3.5 57.78,7.02 64.45,7.02 64.55,7.11 65.11,7.11 C6.+ 68.8,7 | 54.26,10.54 54.26,10.79 | 54.26,10.79 J3.4 | J3.5 54.26,10.54 | 54.26,10.54 J3.3 55.15,9.27 55.53,8.89 J3.5 | 77.33,7.2 X1.10 77.25,7.5 76.75,7.5 | J3.5 55.53,9.53 53.63,9.53 51.09,6.99 42.32,6.99 J2.5 39.78,9.27 38.7,10.35 | 38.7,10.35 38.64,10.41 38.64,11.68 J2.4 | J1.4 23.53,10.54 23.59,10.48 | 23.59,10.48 J1.5 | J2.3 37.62,9.27 38.7,10.35 | 23.59,10.48 22.38,9.27 J1.3 22.3,9.3 22.38,9.14 | 50.32,7.11 50.58,7.11 54.26,10.79 | 54.26,10.79 54.13,10.79 53.75,11.18 53.75,11.05 52.86,10.16 | 66.07,7.11 57.94,7.11 57.7,7.35 | 57.7,7.35 57.44,7.62 | 64.55,6.6 63.53,6.6 64.04,6.1 61.5,6.1 | 61.5,6.1 57.44,6.1 55.04,8.49 | 55.04,8.49 54.39,9.14 53.88,9.14 51.34,6.6 | 48.29,6.6 41.18,6.6 40.67,7.11 | 51.34,6.6 48.29,6.6 | 40.67,7.11 38.13,9.65 38.64,9.65 41.18,7.11 | 56.42,6.6 57.44,6.6 | 51.34,6.6 54.9,6.6 | 54.9,6.6 56.42,6.6 | 56.42,6.6 56.93,6.1 48.8,6.1 48.29,6.6 | 34.07,6.6 40.16,6.6 40.67,7.11 | 40.67,7.11 39.66,7.11 37.62,9.14 | 54.7,8.13 53.37,8.13 | 54.7,8.13 54.9,8.13 | 54.39,11.18 55.4,10.16 55.4,9.9 | 55.4,9.9 55.4,9.65 | 54.9,7.11 52.36,7.11 | 54.9,7.11 57.44,7.11 | 57.44,7.11 57.94,6.6 | 23.4,9.65 23.91,9.65 26.45,7.11 27.46,7.11 27.56,7.01 | 27.56,7.01 27.97,6.6 27.97,7.11 34.07,7.11 | 34.07,7.11 34.58,6.6 | 34.07,7.11 38.64,7.11 | 38.64,7.11 39.15,7.11 | 38.64,7.11 37.12,8.64 37.12,8.13 36.61,7.62 | 25.43,6.1 26.45,6.1 | 26.45,6.1 48.29,6.1 | 22.38,9.14 25.43,6.1 | 22.38,9.14 22.38,8.13 24.42,6.1 25.43,6.1 | 26.45,6.1 23.4,9.14 | 38.13,9.14 37.12,9.14 36.19,8.21 | 36.19,8.21 35.08,7.11 | 68.8,7 69,7 70.25,5.75 73.5,5.75 73.5,6 76,8.5 78,8.5 78,7 77.25,6.25 75.5,6.25 73.75,4.5 63.1,4.5 62.45,5.15
  Top 1.016: 62.45,5.15 61.5,6.1 | 62.8,5.5 62.75,5.5 | 62.8,5.5 69.75,5.5 | 73.25,5.5 74,5.5 76.75,8.25 76.75,7.5 | 76.75,7.5 76,6.75 74.5,6.75 73.25,5.5 | 69.75,5.5 73.25,5.5 | 69.75,5.5 69,6.25 | 69,6.25 68.75,6.5 64.5,6.5 64,6 68.75,6 69,6.25 | 54.7,8.13 54.7,8.15 55.04,8.49 | C5.1 68.8,7 | 55.4,9.9 J3.5 | 36.31,8.09 36.19,8.21 | 54.9,6.6 54.9,7.11 | 57.7,7.35 57.44,7.11 | 62.45,5.15 62.8,5.5 | 27.56,7.01 27.6,7.05 27.6,7.11
A_DIR  (via drill 0.51)
  Top 0.203: v40.6,18.8 40.6,16.4 LPC1768.56 | v40.6,23 40.6,23.45 42.4,25.25 v42.4,28.05 | v39.55,45.65 40.1,45.65 42.45,48 v44.65,48
  Bottom 0.203: v40.6,18.8 v40.6,23 | v42.4,28.05 42.4,32.15 39.55,35 v39.55,45.65 | v44.65,48 53.45,56.8 A-AXIS.4
A_EN  (via drill 0.51)
  Top 0.203: v32.4,14.5 33,14.5 36.35,17.85 36.35,18.1 LPC1768.50 | v16.8,27.5 16.8,28.35 20.95,32.5 v20.95,36.85 | v23.2,44 24.6,44 v26,45.4 | v30.35,48.05 30.45,48.05 31.45,49.05 32.95,49.05 39.2,55.3 46.95,55.3 50.95,59.3 A-AXIS.5
  Bottom 0.203: v32.4,14.5 30.35,14.5 17.35,27.5 v16.8,27.5 | v20.95,36.85 20.95,38.7 20.85,38.8 20.85,40 23.2,42.35 v23.2,44 | v26,45.4 27.7,45.4 v30.35,48.05
A_STEP  (via drill 0.51)
  Top 0.203: v50.1,19.3 50.1,16.4 LPC1768.75
  Bottom 0.203: v50.1,19.3 63.95,33.15 63.95,38.05 64.55,38.65 64.55,42.35 65.05,42.85 65.05,43.45 61.5,47 61.5,52.85 56.1,58.25 54.5,58.25 53.45,59.3 A-AXIS.3
ADC0
  Top 0.254: ADC0.3 51.9,32.25 48.65,29 46.8,29 46.1,29.7 LPC1768.9
ADC1
  Top 0.254: LPC1768.8 46.6,34.05 47.3,34.75 47.75,34.75 48,35 48,35.75 48.25,36 50.5,36 53,34.5 ADC1.3
ATX_5V  (via drill 0.6)
  Top 0.254: R8.1 25.36,46.47 arc45 25.54,46.54 25.95,47.35 29.8,47.35 arc-45 29.97,47.28 30.75,46.5 39.4,46.5 arc45 39.57,46.57 41.75,48.85 63.15,48.85 arc-45 63.32,48.68 64.5,47.5 66.56,47.5 arc45 66.74,47.57 C9.+
  Top 0.508: C15.1 23.75,15 | C9.+ 68.15,49 68.24,48.91
  Top 0.813: 23.75,15 23.75,16.5 25.25,18 26.86,18 RS244.8
  Top 1.016: 77.32,24.57 X1.6 | 77.32,24.57 75.22,26.67 75.22,30.86 X1.4 76.54,32.97 74.58,34.92 74.58,48.9 R3.2 68.24,48.91 68.1,48.77 | 77.32,24.57 76.93,24.57 74.71,22.35 74.71,14.85 X1.19 X1.20 | 24,15.25 23.75,15 v23.75,13.75
  Bottom 0.508: 71.75,7.75 71.8,7.75 X1.20
  Bottom 0.813: 71.75,7.75 68.5,5.5 29.25,5.5 29,5.25 17.5,5.25 15.5,7 15.5,14 17.25,16.5 19,16.5 20,15.5 20,15 21.25,13.75 v23.75,13.75
B_DIR  (via drill 0.51)
  Top 0.203: v45.15,17.95 45.15,16.4 LPC1768.65 | v64.2,43.15 v64.2,46.65
  Bottom 0.203: v45.15,17.95 46.25,17.95 48.25,19.95 48.25,20.5 57.5,29.75 59.95,29.75 63.5,33.3 63.5,38.25 64.1,38.85 64.1,43.05 v64.2,43.15 | v64.2,46.65 64.2,54.2 66.8,56.8 B-AXIS.4
B_EN  (via drill 0.51)
  Top 0.203: v43.7,14.8 42.85,14.8 42.15,15.5 42.15,16.35 LPC1768.59 | v63.7,13.6 68.55,13.6 70.05,15.1 70.05,30.5 70.3,30.75 70.3,31.35 70.05,31.6 70.05,42.2 v71,43.15 | v69.15,52.35 65.35,56.15 65.35,58.2 64.25,59.3 B-AXIS.5
  Bottom 0.203: v43.7,14.8 49.15,14.8 50.35,13.6 v63.7,13.6 | v71,43.15 71,43.85 70.35,44.5 70.35,50.85 69.15,52.05 v69.15,52.35
B_STEP  (via drill 0.51)
  Top 0.203: v50.25,14.9 49.65,15.5 49.65,16.35 LPC1768.74
  Bottom 0.203: v50.25,14.9 50.4,14.9 64.75,29.25 65.85,29.25 66.9,30.3 66.9,30.8 67.9,31.8 68.4,31.8 69.65,33.05 69.65,50.7 68.25,52.1 68.25,57.85 66.8,59.3 B-AXIS.3
BAR_INT
  Top 0.203: LPC1768.76 61.66,18.13 64.55,15.24 65.31,15.24 INTERCONNECT.19
CD_SD  (via drill 0.51)
  Top 0.203: 15.65,32.05 15.6,32 15.6,31.15 MICRO_SD.CD2 | 15.65,32.05 19.5,35.9 R1.1 | v46.3,19.15 46.3,17.95 45.65,17.3 45.65,16.4 LPC1768.66 | v47.5,49.7 44.35,49.7 v42.9,51.15 | v36.8,55.3 31.15,60.95 30.4,60.95 30.1,61.25 22,61.25 15.5,54.75 v15.15,54.75 | 15.65,32.05 v10.75,36.95
  Bottom 0.203: v46.3,19.15 57.35,30.2 59.8,30.2 61.4,31.8 61.4,37.35 62.9,38.85 62.9,41.8 60.75,43.95 56.85,43.95 54.3,46.5 50.7,46.5 v47.5,49.7 | v42.9,51.15 41.75,51.15 37.6,55.3 v36.8,55.3 | v15.15,54.75 15.15,53.45 15.35,53.25 15.35,52.65 14.75,52.05 13,52.05 10.75,49.8 v10.75,36.95
CL_INT
  Top 0.203: LPC1768.95 58.14,27.63 64.55,34.04 66.83,34.04 INTERCONNECT.6
CS_SD  (via drill 0.51)
  Top 0.203: v45.7,13.95 44.15,15.5 44.15,16.35 LPC1768.63 | v34.1,12.65 32.85,12.65 31.75,11.55 29.85,11.55 29.05,10.75 28.15,10.75 27.15,11.75 27.15,12.25 v25.35,14.05 | v6.85,29.95 6.85,30.15 5.8,31.2 MICRO_SD.2
  Bottom 0.203: v45.7,13.95 46.5,13.95 47.6,12.85 47.6,11.65 46.5,10.55 38.5,10.55 37.7,11.35 37.7,12.4 36.8,13.3 35.3,13.3 34.65,12.65 v34.1,12.65 | v25.35,14.05 19.6,19.8 17,19.8 v6.85,29.95
D4_INT
  Top 0.203: LPC1768.93 59.68,26.63 64.55,31.5 66.83,31.5 INTERCONNECT.8
D5_INT
  Top 0.203: LPC1768.90 62.25,25.13 65.06,27.94 65.31,27.94 INTERCONNECT.9
D6_INT
  Top 0.203: INTERCONNECT.10 67.98,28.07 67.09,28.96 64.67,28.96 61.37,25.65 51.88,25.65 LPC1768.91
D7_INT
  Top 0.203: INTERCONNECT.11 64.93,25.27 63.79,24.13 LPC1768.88
DEBUG_INT
  Top 0.203: INTERCONNECT.20 67.98,15.37 67.09,16.26 64.55,16.26 62.16,18.64 51.94,18.64 LPC1768.77
E-STOP  (via drill 0.51)
  Top 0.203: v39,14.9 38.65,15.25 38.65,16.35 LPC1768.52 | v46.2,11.4 50.05,11.4 51.15,10.3 v51.5,10.3 | v31.3,8.7 29.4,8.7 27.75,10.35 v26.35,10.35 | v16,19.65 v20.9,19.65
  Bottom 0.203: v39,14.9 41.85,14.9 43.85,12.9 44.7,12.9 v46.2,11.4 | v51.5,10.3 51.55,10.25 51.55,8.85 49.35,6.65 47.55,6.65 47.2,6.3 33.7,6.3 v31.3,8.7 | v26.35,10.35 26.35,10.6 27.15,11.4 27.15,13.4 v20.9,19.65 | v16,19.65 4.25,31.4 4.25,48.6 5.75,50.1 5.75,50.45 E-STOP.4
EN_INT
  Top 0.203: INTERCONNECT.4 67.98,35.69 67.09,36.58 64.55,36.58 64.04,36.07 64.04,35.56 58.1,29.62 51.84,29.62 LPC1768.99
FOO_INT
  Top 0.203: INTERCONNECT.7 65.18,30.35 60.99,26.16 51.88,26.16 LPC1768.92
GND  (via drill 0.6)  (19 unrouted)
  Top 0.254: R26.1 49.15,37.1 v48.25,38 | ADC0.2 56.25,32
  Top 0.813: 44.75,41.5 v44.75,43.25
  Bottom 0.203: C13.2 C14.2
  Bottom 0.254: v48.25,38 49.72,37.5 JP1.2
  Bottom 0.813: v44.75,43.25 46.25,44.75 v47.75,44.75 v47.75,47.5 | J2.6 40.51,12.49 v40.5,14
  pour Top (no thermals): 0,0 0,62 80,62 80,0
  pour Bottom (no thermals): 0,0 0,62 80,62 80,0
JTAG_TCK
  Top 0.254: R26.2 48.8,35.05 48.1,33.85 LPC1768.5
JTAG_TDI  (via drill 0.6)
  Top 0.254: LPC1768.2 49.6,30.85 v48.65,30.25
  Top 1.016: JP1.5 R13.2
  Bottom 0.254: v48.65,30.25 50.75,32 51.6,32 52.25,32.65 52.25,34.5 54.25,36.5 55.25,36.5 56.75,38 57.84,38 JP1.5
JTAG_TDO  (via drill 0.6)
  Top 0.254: LPC1768.1 50.1,32.6 50.5,33 v51.25,33
  Top 1.016: JP1.4 R18.2
  Bottom 0.254: v51.25,33 51.65,34.8 54,37.25 55,37.25 56.5,38.75 56.5,39 56.55,39.25 JP1.4
JTAG_TMS  (via drill 0.6)
  Top 0.254: LPC1768.3 49.1,32.85 50.25,33.5 v50.6,34.75
  Top 1.016: JP1.6 R2.2
  Bottom 0.254: v50.6,34.75 53.75,38 54.5,38 55.5,39 55.5,40.25 56,40.75 60.37,40.75 JP1.6
JTAG_TRST  (via drill 0.6)
  Top 0.254: LPC1768.4 48.6,33.35 v49.25,34
  Top 1.016: JP1.3 R19.2
  Bottom 0.254: v49.25,34 49.25,34.74 JP1.3
MISO_SD  (via drill 0.51)
  Top 0.203: v39.55,19.65 42.8,19.65 43.35,19.1 43.35,18.5 43.15,18.3 43.15,16.4 LPC1768.61 | v31.5,15.35 29.85,17 29.85,19.45 v30.25,19.85 | v25.05,21.55 20.1,21.55 v19.8,21.25 | v6.45,35.65 5.4,36.7 MICRO_SD.7
  Bottom 0.203: v39.55,19.65 38.75,19.65 38.15,20.25 37.55,20.25 35.7,18.4 35.7,16.6 34.45,15.35 v31.5,15.35 | v30.25,19.85 26.75,19.85 v25.05,21.55 | v19.8,21.25 18.8,20.25 17.7,20.25 6.45,31.5 v6.45,35.65
MOSI_SD  (via drill 0.51)
  Top 0.203: v42.5,18.8 42.6,18.7 42.6,16.4 LPC1768.60 | v38.95,23 v41.45,20.5 | v18.25,23.05 v23.55,23.05 | v7.3,31.8 6.8,32.3 5.4,32.3 MICRO_SD.3
  Bottom 0.203: v42.5,18.8 42.5,19.45 v41.45,20.5 | v38.95,23 38.2,23 38.15,23.05 v23.55,23.05 | v18.25,23.05 16.05,23.05 v7.3,31.8
N$1
  Top 0.813: 3V.A 27.06,48.2 arc45 27.13,48.28 R5.2
N$2
  Top 0.254: USB_UP.A 11.3,17.1 11.3,17.3 11.5,17.5 13.5,17.5 18.5,25 R9.2
N$3
  Top 0.813: R8.2 5V.A
N$4
  Bottom 0.254: EXT_POWER_SW.2 57.75,16 58.75,15 63.5,15 64.75,13.75 73,13.75 74,12.75 74,7.25 70.25,3.5 69.75,3.5 POWER_SW.2
N$10
  Top 0.61: 12V.A R14.2
N$20  (via drill 0.51)
  Top 0.203: v49.8,28.95 50.95,30.1 51.85,30.1 LPC1768.100 | v44.1,28.95 42.7,28.95 40.6,31.05 40.6,31.85 LPC1768.20
  Bottom 0.203: v44.1,28.95 v49.8,28.95
N$31
  Top 0.203: C8.1 43.73,35.55 44.61,34.67 LPC1768.12
  Top 1.016: L1.1 43.47,37.73 C10.1 C8.1
N$32
  Top 0.203: C8.2 41.94,35.81 43.09,34.67 43.09,31.9 LPC1768.15
  Top 1.016: L2.1 41.56,37.84 C10.2 C8.2
N$33  (via drill 0.51)
  Top 0.203: v36,32.4 36,32.05 37.85,30.2 37.85,27.3 37.2,26.65 36.4,26.65 LPC1768.33
  Top 0.254: 12MHZ.2 32.8,36.7 34.5,35 37.6,35 39.1,33.5 LPC1768.23
  Bottom 0.203: v36,32.4 36,33.4 32.85,36.55 32.85,36.75 12MHZ.2
  Bottom 0.254: C13.1 32.84,36.87 12MHZ.2
N$34
  Top 0.254: LPC1768.22 39.6,34.85 12MHZ.1
  Bottom 0.254: C14.1 37.63,36.84 12MHZ.1
N$35
  Top 0.203: C11.1 47.03,35.56 45.62,33.91 45.62,31.9 LPC1768.10
  Top 1.016: C11.1 C12.1 46.84,38.07 L3.1
N$38
  Top 0.203: C11.2 45.24,35.17 45.12,34.54 45.12,31.9 LPC1768.11
  Top 1.016: C11.2 C12.2 45.25,37.48 L4.1
OK_INT
  Top 0.203: LPC1768.94 59.17,27.13 65.06,33.02 65.31,33.02 INTERCONNECT.5
PIEZO  (via drill 0.6)
  Top 0.254: v31.5,10.25 31.5,9.86 arc45 31.57,9.68 32.25,9 33.5,9 35.25,13 45.9,13 arc45 46.07,13.07 46.6,13.6 LPC1768.68 arc-45 LPC1768.68
  Bottom 0.254: PIEZO.+ 18.45,8.75 21.1,6.55 28.35,6.55 v31.5,10.25
PWR_ON
  Bottom 0.254: POWER_SW.3 70.4,2.4 75,7 74.75,18.5 | 74.75,18.5 74.75,30.05 X1.14 | EXT_POWER_SW.3 55.75,16.25 57,17.5 60.75,17.5 62,16.25 68.75,16.25 70.75,18.25 74.5,18.25 74.75,18.5
RESET~  (via drill 0.51)
  Top 0.203: v35.75,40.15 38.65,37.25 38.65,36.45 40.05,35.05 40.05,34.5 40.7,33.85 40.95,33.85 42.1,32.7 42.1,31.9 LPC1768.17
  Top 0.254: RESET_SW.1 29.61,27.17 arc-45 29.79,27.1 R28.1
  Bottom 0.203: v35.75,40.15 35.75,40.05 36.55,39.25 36.55,37.75 36.2,37.4 36.2,34.5 38.1,32.6 38.1,32 33.45,27.35 29,27.35 28.85,27.2 RESET_SW.1
RS485_RX
  Top 0.203: LPC1768.47 34.9,19.63 33.31,18.03 RS244.1
RS485_TX
  Top 0.203: LPC1768.46 34.77,20.13 33.05,21.84 RS244.4
RS485A
  Top 0.203: J1.1 20.48,9.27 22.38,11.18 22.38,16.76 24.92,19.3 RS244.7
  Bottom 0.254: J1.1 20,8.99 20,8.5 21.5,7.25 28.2,7.25 30.75,11.25 34.75,11.25 35.02,10.77 J2.1 35,9.23 35,8.75 37,6.75 47,6.75 49.52,9.27 J3.1
RS485B
  Top 0.203: J1.2 20.99,16.38 24.92,20.32 26.64,20.32 RS244.6
  Bottom 0.254: J1.2 21,11.8 21,8.75 21.75,8 28,8 30.31,11.81 J2.2 36.23,8.77 37.5,7.5 46.5,7.5 50.75,11.75 51.66,11.75 J3.2
RS_INT
  Top 0.203: INTERCONNECT.3 64.93,35.43 58.58,29.08 51.9,29.08 LPC1768.98
RX_ENABLE
  Top 0.203: LPC1768.48 35.29,19.13 33.43,17.27 30.77,17.27 30.26,17.78 30.26,18.67 30.77,19.18 30.85,19.2 31.9,19.2 RS244.2 31.97,19.18
SCK_SD  (via drill 0.51)
  Top 0.203: v43.8,20.95 43.8,18.35 43.65,18.2 43.65,16.4 LPC1768.62 | v17,29.7 16.8,29.7 16.6,29.5 10.95,29.5 5.95,34.5 5.4,34.5 MICRO_SD.5
  Bottom 0.203: v43.8,20.95 40.9,23.85 34.9,23.85 34.85,23.8 23.95,23.8 22.1,25.65 21.05,25.65 v17,29.7
SCL3
  Top 0.254: R27.1 28.07,37.63 30.75,33.75 38,33.75 38.5,33.25 38.5,33.2 38.6,33.1 LPC1768.24
  Top 0.813: R27.1 I2C.4
SDA3
  Top 0.254: LPC1768.25 38.1,32.9 37.75,33.25 30.25,33.25 27.9,36.8 25.9,36.8 25.07,37.63 R17.1
  Top 0.813: R17.1 I2C.3
TX_ENABLE
  Top 0.203: RS244.3 31.02,20.57 30.4,21.2 | 30.4,21.2 30.26,21.34 30.26,22.1 30.89,22.73 33.31,22.73 33.81,22.23 33.81,21.97 35.08,20.6 36.28,20.6 LPC1768.45 | 30.24,21.24 30.35,21.15 30.4,21.2
  Top 0.305: R4.2 29.25,20 30.24,21.24 30.25,21.25
USB_5V
  Top 0.254: X2.1 R10.1
USB_D+
  Top 0.254: R21.2 5.39,20.75 5.5,21 13.07,21.07 20,30.25 30.89,30.25 arc-45 31.07,30.18 32,29.25 32,28.61 arc45 32.07,28.43 32.25,28.25 34.24,28.25 arc45 34.42,28.32 34.7,28.6 36.28,28.6 arc45 LPC1768.29
USB_D+_CON
  Top 0.254: R21.1 9.65,18.6 10.25,18 10.25,16.75 9.75,16.25 9.75,13.25 10,13 10,11.93 X2.3
USB_D-
  Top 0.254: R20.2 7.29,20.25 13.47,20.32 20.3,29.4 30.59,29.4 arc-45 30.77,29.33 31.1,29 31.1,28.5 arc45 31.17,28.33 31.75,27.75 34.65,27.75 arc45 34.82,27.82 35.1,28.1 36.28,28.1 arc45 LPC1768.30
USB_D-_CON
  Top 0.254: R20.1 7.25,17.25 8.05,16.25 8.05,13.75 7.5,13 7.5,11.68 X2.2
USB_UP_LED
  Top 0.254: 31.25,27.1 29.82,28.43 arc45 29.64,28.5 20.75,28.5 19.68,27.43 arc45 19.61,27.25 R9.1 | 36.28,27.1 36.87,27.1 | 31.25,27.1 31.2,27.1 | 31.25,27.1 36.28,27.1 | 36.28,27.1 arc45 LPC1768.32
VBUS  (via drill 0.6)
  Top 0.254: R10.2 13.89,19.5 arc45 14.07,19.57 18.25,25.75 24.14,25.75 arc45 24.32,25.82 v25.75,27.25 | v40.25,25.5 40.25,30.38 arc45 40.2,30.5 40.1,30.6 LPC1768.21 arc-45 LPC1768.21
  Bottom 0.254: v25.75,27.25 26.14,27.25 arc-45 26.32,27.18 28,25.5 v40.25,25.5
X+_INT
  Top 0.203: INTERCONNECT.12 67.72,25.27 66.58,26.42 64.42,26.42 62.64,24.64 LPC1768.89
X-_INT
  Top 0.203: INTERCONNECT.13 65.06,23.11 51.87,23.11 LPC1768.86
X_DIR  (via drill 0.51)
  Top 0.203: v39.15,30.4 39.15,27.4 37.4,25.65 36.4,25.65 LPC1768.35
  Bottom 0.203: v39.15,30.4 39.15,34.2 38.65,34.7 38.65,39.1 33.5,44.25 33.5,51 31.7,52.8 18.25,52.8 14.3,56.75 13.5,56.75 X-AXIS.4
X_EN  (via drill 0.51)
  Top 0.203: v37.25,32.3 37.25,31.4 38.3,30.35 38.3,27.15 37.3,26.15 36.4,26.15 LPC1768.34 | v29.1,37.85 29.1,38.85 28.7,39.25 28.7,39.9 26.9,41.7 v26.65,41.7 | v15.15,50.6 15.15,51.1 10.95,55.3 10.3,55.3 9.45,56.15 9.45,57.8 10.95,59.3 X-AXIS.5
  Bottom 0.203: v37.25,32.3 37.05,32.3 36.3,31.55 35.4,31.55 v29.1,37.85 | v26.65,41.7 21.6,46.75 19,46.75 v15.15,50.6
X_MAX  (via drill 0.51)
  Top 0.203: v39.4,26.5 37.55,24.65 36.4,24.65 LPC1768.37 | v41,34.7 39.1,36.6 39.1,37.95 36.05,41 v31.75,41 | v23.1,40.85 v20.55,40.85 | v17.9,44.15 17.9,44.25 16.4,45.75 16.4,47.6 19.25,50.45 X-MAX.4
  Bottom 0.203: v39.4,26.5 40.1,27.2 42.7,27.2 43.25,27.75 43.25,32.45 v41,34.7 | v31.75,41 28.5,41 28.35,40.85 v23.1,40.85 | v20.55,40.85 19.25,40.85 17.9,42.2 v17.9,44.15
X_MIN  (via drill 0.51)
  Top 0.203: v27.25,27.65 27.25,26.55 28.5,25.3 31.8,25.3 32.05,25.55 32.05,25.7 32.65,26.3 34.1,26.3 35.25,25.15 36.35,25.15 LPC1768.36 | v25.2,31.3 v21.8,34.7 | v16.95,39.55 v14.8,41.7
  Bottom 0.203: v27.25,27.65 27.25,29.25 v25.2,31.3 | v21.8,34.7 v16.95,39.55 | v14.8,41.7 14.8,42.1 15.15,42.45 15.15,48.7 13.65,50.2 13.65,50.45 X-MIN.4
X_STEP  (via drill 0.51)
  Top 0.203: v44.2,30.4 47.15,27.45 47.15,16.4 LPC1768.69 | v40.55,48.9 40.55,51.1 v40.6,51.15 | v34.6,56.35 34.4,56.35 29.95,60.8 22.7,60.8 v19.8,57.9
  Bottom 0.203: v44.2,30.4 44.2,42.55 40.55,46.2 v40.55,48.9 | v40.6,51.15 40.05,51.15 36.75,54.45 36.5,54.45 v34.6,56.35 | v19.8,57.9 14.9,57.9 13.5,59.3 X-AXIS.3
Y+_INT
  Top 0.203: LPC1768.87 64.3,23.63 64.55,23.88 66.83,23.88 INTERCONNECT.14
Y-_INT
  Top 0.203: INTERCONNECT.15 53.71,20.19 LPC1768.80
Y_DIR  (via drill 0.51)
  Top 0.203: v34.5,24.65 35.5,23.65 36.35,23.65 LPC1768.39 | v29.6,39.5 29.6,40.25 v28.1,41.75 | v28.3,48.3 28.3,55.3 26.85,56.75 Y-AXIS.4
  Bottom 0.203: v34.5,24.65 26.5,24.65 23.9,27.25 23.9,34.35 27.2,37.65 27.75,37.65 v29.6,39.5 | v28.1,41.75 28.1,42.15 25.15,45.1 25.15,45.7 27.75,48.3 v28.3,48.3
Y_EN  (via drill 0.51)
  Top 0.203: v41.55,28.95 41.55,25 40.7,24.15 36.4,24.15 LPC1768.38
  Bottom 0.203: v41.55,28.95 41.55,32.4 39.1,34.85 39.1,39.25 33.95,44.4 33.95,51.15 31.85,53.25 25.7,53.25 22.75,56.2 22.75,57.85 24.25,59.35 Y-AXIS.5
Y_MAX  (via drill 0.51)
  Top 0.203: v29.85,12.65 32.25,12.65 38.7,19.1 38.7,20.2 37.3,21.6 36.4,21.6 LPC1768.43 | v17.25,47.3 19.05,49.1 21.15,49.1 v26.15,54.1
  Bottom 0.203: v29.85,12.65 16.75,25.75 16.2,25.75 12.6,29.35 12.6,37.55 15.65,40.6 15.65,45.7 v17.25,47.3 | v26.15,54.1 32.2,54.1 35.7,50.6 37.6,50.6 37.75,50.45 Y-MAX.4
Y_MIN  (via drill 0.51)
  Top 0.203: v37.85,22.2 37.85,22.55 37.3,23.1 36.4,23.1 LPC1768.40
  Bottom 0.203: v37.85,22.2 37.85,21.15 35.25,18.55 35.25,16.75 34.7,16.2 29.25,16.2 16.15,29.3 16.15,30 20,33.85 22.8,33.85 27.05,38.1 27.6,38.1 28.75,39.25 28.75,39.8 29.3,40.35 31.25,40.35 31.45,40.15 32.05,40.15 33.45,41.55 33.45,43.7 33.05,44.1 33.05,49 31.95,50.1 31.95,50.4 Y-MIN.4
Y_STEP  (via drill 0.51)
  Top 0.203: v49.2,24.35 47.65,22.8 47.65,16.4 LPC1768.70 | v60.5,37.2 60.6,37.3 60.6,40.2 59.85,40.95 v53.55,40.95 | v33.7,55.5 32.15,55.5 29.4,58.25 27.9,58.25 26.85,59.3 Y-AXIS.3
  Bottom 0.203: v49.2,24.35 49.75,24.35 56.5,31.1 57,31.1 57.65,31.75 57.65,35.3 59.55,37.2 v60.5,37.2 | v53.55,40.95 48.65,45.85 48.65,47.85 48.1,48.4 46.2,48.4 44.95,47.15 43.45,47.15 36.6,54 36.05,54 34.55,55.5 v33.7,55.5
Z+_INT
  Top 0.203: LPC1768.81 63.84,20.63 64.55,21.34 66.83,21.34 INTERCONNECT.16
Z-_INT
  Top 0.203: LPC1768.78 62.69,19.13 64.04,17.78 65.31,17.78 INTERCONNECT.17
Z_DIR  (via drill 0.51)
  Top 0.203: v34.4,17.05 34.4,17.5 35.5,18.6 36.35,18.6 LPC1768.49 | v29.25,22.2 28.4,22.2 25.45,25.15 v24.85,25.15 | v19.55,32.25 v19.55,34.75 | v17.9,45.4 19,46.5 v23.6,46.5 | v29.6,50.75 30.05,50.75 32.95,53.65 36.95,53.65 40.1,56.8 Z-AXIS.4
  Bottom 0.203: v29.25,22.2 v34.4,17.05 | v24.85,25.15 24.85,25.7 23.45,27.1 23.45,28.35 v19.55,32.25 | v19.55,34.75 19.55,35.8 16.1,39.25 16.1,43.6 v17.9,45.4 | v23.6,46.5 25.35,46.5 v29.6,50.75
Z_EN  (via drill 0.51)
  Top 0.203: v37.85,19.4 37.85,20.45 37.2,21.1 36.4,21.1 LPC1768.44 | v13.9,35 12.55,36.35 v12.55,41.7 | v12.05,45.4 13.4,46.75 14.05,46.75 17.9,50.6 17.9,51.05 21.8,54.95 v27.45,54.95
  Bottom 0.203: v37.85,19.4 37.85,18.15 33.35,13.65 30.6,13.65 17.6,26.65 16.5,26.65 13.9,29.25 v13.9,35 | v12.55,41.7 12.05,42.2 v12.05,45.4 | v27.45,54.95 32,54.95 36.35,59.3 37.55,59.3 Z-AXIS.5
Z_MAX  (via drill 0.51)
  Top 0.203: v34.75,13.9 39.15,13.9 40.15,14.9 40.95,14.9 41.6,15.55 41.6,16.35 LPC1768.58 | v13.5,36.55 v13.5,39.6 | v30.1,51.95 30.4,51.95 v32.95,54.5 | v37.45,52 58.15,52 59.95,50.2 Z-MAX.4
  Bottom 0.203: v34.75,13.9 34.2,13.9 33.5,13.2 30.45,13.2 17.45,26.2 16.35,26.2 13.05,29.5 13.05,36.1 v13.5,36.55 | v13.5,39.6 11.2,41.9 11.2,49.65 13.15,51.6 19.1,51.6 19.5,52 30.05,52 v30.1,51.95 | v32.95,54.5 34.95,54.5 v37.45,52
Z_MIN  (via drill 0.51)
  Top 0.203: v41.7,17.85 41.15,17.3 41.15,16.4 LPC1768.57 | v60.4,33.1 v62.25,34.95
  Bottom 0.203: v41.7,17.85 43.85,17.85 56.65,30.65 59.65,30.65 60.6,31.6 60.6,32.9 v60.4,33.1 | v62.25,34.95 62.25,37.6 63.35,38.7 63.35,43.3 60.15,46.5 58.05,46.5 54.4,50.15 54.15,50.15 Z-MIN.4
Z_STEP  (via drill 0.51)
  Top 0.203: v49.25,17.9 49.15,17.8 49.15,16.4 LPC1768.73 | v61.95,55.5 56.65,60.8 41.65,60.8 40.15,59.3 Z-AXIS.3
  Bottom 0.203: v49.25,17.9 50.9,17.9 64.8,31.8 65.9,31.8 66.9,32.8 66.9,42.8 61.95,47.75 v61.95,55.5
ZERO_INT
  Top 0.203: INTERCONNECT.18 67.72,17.65 66.58,18.8 64.8,18.8 63.91,19.68 51.91,19.68 LPC1768.79

### Text on the board
tPlace: PIEZO | Instructions: wiki.makerbot.com/mb2 | Design By: | NOT ETHERNET - THESE ARE RS485!!!!! | MakerBot.com | License: GPLv3 | c 2010 | MakerBot | MotherBoard | v2.4